# Altium schematic sheet SWITCHING.SchDoc
size A4; DrawnBy: Jakov Sola; SheetNumber: 4; SheetTotal: 6
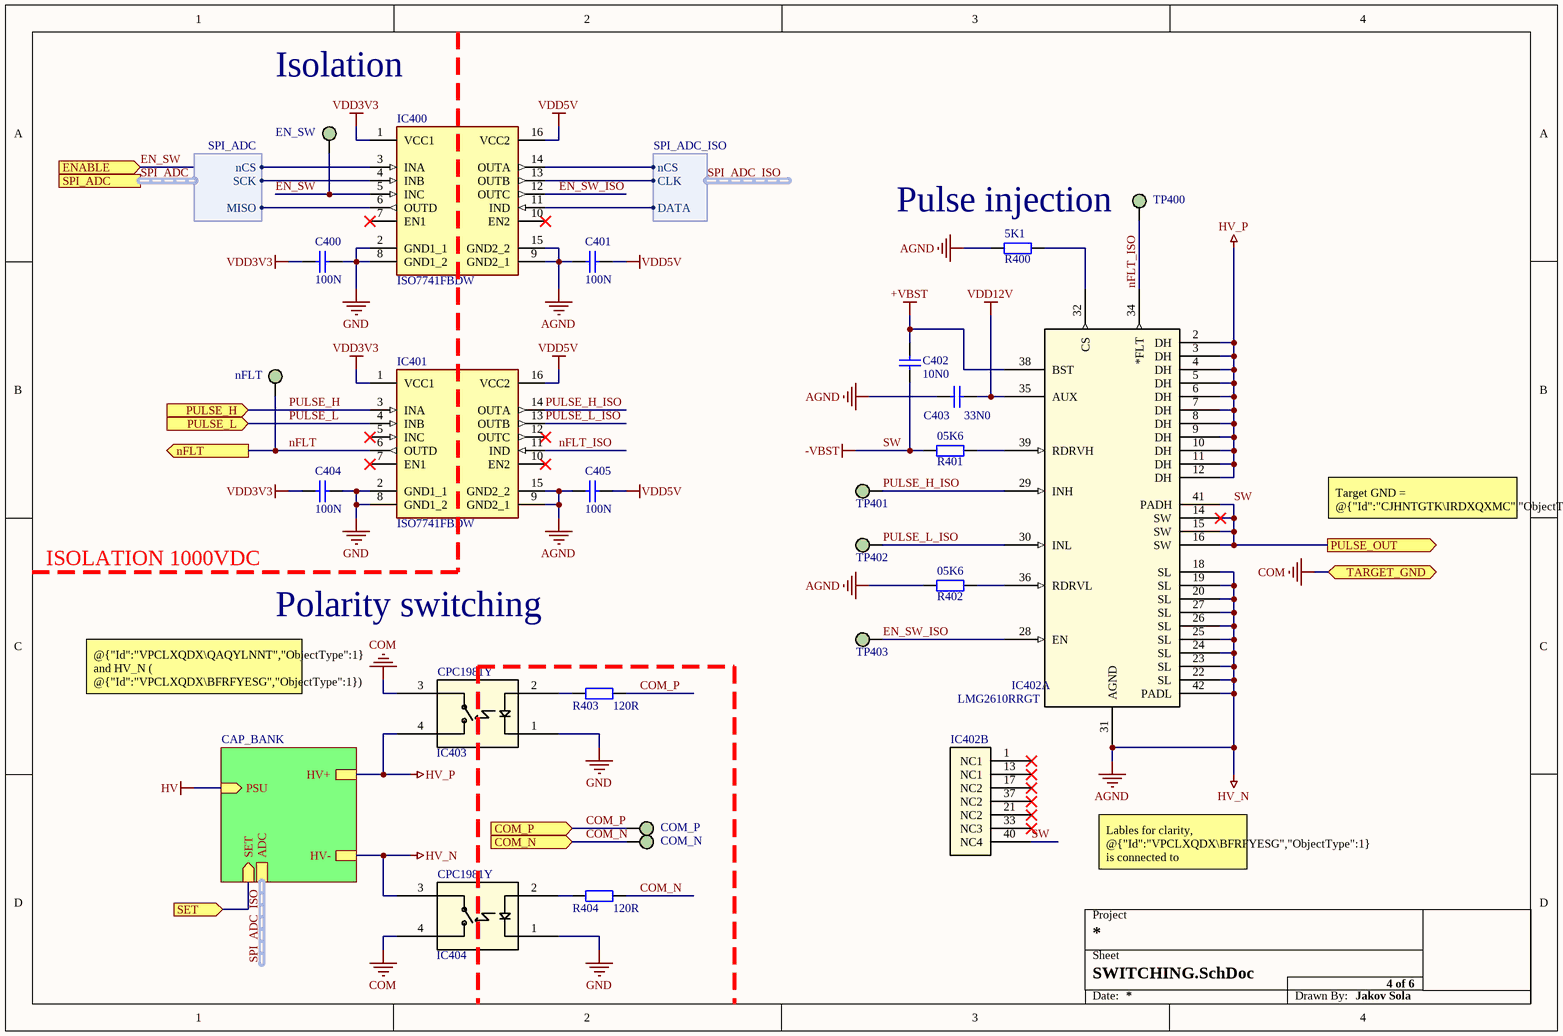
[diagram p0: SWITCHING.SchDoc]

## Parts
C400  VALUE_4C: 100N  [CAPC0603N]  (hidden comment: Cap)
C401  VALUE_4C: 100N  [CAPC0603N]  (hidden comment: Cap)
C402  VALUE_4C: 10N0  [CAPC0603N]  (hidden comment: Cap)
C403  VALUE_4C: 33N0  [CAPC0603N]  (hidden comment: Cap)
C404  VALUE_4C: 100N  [CAPC0603N]  (hidden comment: Cap)
C405  VALUE_4C: 100N  [CAPC0603N]  (hidden comment: Cap)
COM_N  TP  [TP]  (value not drawn)
COM_P  TP  [TP]  (value not drawn)
EN_SW  TP  [TP]  (value not drawn)
IC400  ISO7741FBDW  [SOIC16]
IC401  ISO7741FBDW  [SOIC16]
IC402  LMG2610RRGT  [XLMG2610RRGT]  (parts A,B of 2)
IC403  SSR_SPST_NO  [CPC1981Y]  (value not drawn)
IC404  SSR_SPST_NO  [CPC1981Y]  (value not drawn)
nFLT  TP  [TP]  (value not drawn)
R400  value 5K1  [RESC0603N]  (hidden comment: Res)
R401  VALUE_4C: 05K6  [RESC0603N]  (hidden comment: Res)
R402  VALUE_4C: 05K6  [RESC0603N]  (hidden comment: Res)
R403  VALUE_4C: 120R  [RESC0603N]  (hidden comment: Res)
R404  VALUE_4C: 120R  [RESC0603N]  (hidden comment: Res)
TP400  TP  [TP]  (value not drawn)
TP401  TP  [TP]  (value not drawn)
TP402  TP  [TP]  (value not drawn)
TP403  TP  [TP]  (value not drawn)

## Sub-sheets
CAP_BANK = CAP_BANK.SchDoc: PSU (in), ADC (harness SPI_ADC), SET (in), HV+, HV-

## Ports
COM_N (in), COM_P (in), ENABLE (in), nFLT (out), PULSE_H (in), PULSE_L (in), PULSE_OUT (out), SET (in), SPI_ADC (harness SPI_ADC), TARGET_GND (bidir)

## Harnesses
SPI_ADC_ISO: nCS, DATA, CLK
SPI_ADC: nCS, SCK, MISO

## Nets
+VBST: C402.2 IC402.38(BST)
AGND: C401.2 C403.1 C405.2 IC400.9(GND2_1) IC400.15(GND2_2) IC401.9(GND2_1) IC401.15(GND2_2) IC402.18(SL) IC402.19(SL) IC402.20(SL) IC402.22(SL) IC402.23(SL) IC402.24(SL) IC402.25(SL) IC402.26(SL) IC402.27(SL) IC402.31(AGND) IC402.42(PADL) IC404.3(NOCL1) R400.1 R402.1 ; sheet CAP_BANK/HV-  [also labelled HV_N]
COM: IC403.3(NOCL1) IC404.4(NOOP2) ; port TARGET_GND
GND: C400.1 C404.1 IC400.2(GND1_1) IC400.8(GND1_2) IC401.2(GND1_1) IC401.8(GND1_2) IC403.1(-) IC404.1(-)
HV: sheet CAP_BANK/PSU
HV_P: IC402.2(DH) IC402.3(DH) IC402.4(DH) IC402.5(DH) IC402.6(DH) IC402.7(DH) IC402.8(DH) IC402.9(DH) IC402.10(DH) IC402.11(DH) IC402.12(DH) IC403.4(NOOP2) ; sheet CAP_BANK/HV+
SW: C402.1 IC402.14(SW) IC402.15(SW) IC402.16(SW) IC402.40(NC4) IC402.41(PADH) R401.1 ; port PULSE_OUT  [also labelled -VBST]
VDD3V3: C400.2 C404.2 IC400.1(VCC1) IC401.1(VCC1)
VDD5V: C401.1 C405.1 IC400.16(VCC2) IC401.16(VCC2)
VDD12V: C403.2 IC402.35(AUX)
COM_N: COM_N.TP R404.2 ; port COM_N
COM_P: COM_P.TP R403.2 ; port COM_P
EN_SW: EN_SW.TP IC400.5(INC) ; port ENABLE
EN_SW_ISO: IC400.12(OUTC) IC402.28(EN) TP403.TP
nFLT: IC401.6(OUTD) nFLT.TP ; port nFLT
nFLT_ISO: IC401.11(IND) IC402.34(*FLT) TP400.TP
PULSE_H: IC401.3(INA) ; port PULSE_H
PULSE_H_ISO: IC401.14(OUTA) IC402.29(INH) TP401.TP
PULSE_L: IC401.4(INB) ; port PULSE_L
PULSE_L_ISO: IC401.13(OUTB) IC402.30(INL) TP402.TP
SET: port SET, sheet CAP_BANK/SET
SPI_ADC.MISO: IC400.6(OUTD) ; port SPI_ADC.MISO
SPI_ADC.nCS: IC400.3(INA) ; port SPI_ADC.nCS
SPI_ADC.SCK: IC400.4(INB) ; port SPI_ADC.SCK
SPI_ADC_ISO.CLK: IC400.13(OUTB) ; sheet CAP_BANK/ADC.CLK
SPI_ADC_ISO.DATA: IC400.11(IND) ; sheet CAP_BANK/ADC.DATA
SPI_ADC_ISO.nCS: IC400.14(OUTA) ; sheet CAP_BANK/ADC.nCS
NetIC402_32: IC402.32(CS) R400.2
NetIC402_36: IC402.36(RDRVL) R402.2
NetIC402_39: IC402.39(RDRVH) R401.2
NetIC403_2: IC403.2(+) R403.1
NetIC404_2: IC404.2(+) R404.1

Not connected (* = marked no-connect by the designer): IC400 7(EN1)* 10(EN2)*; IC401 5(INC)* 7(EN1)* 10(EN2)* 12(OUTC)*; IC402 1(NC1)* 13(NC1)* 17(NC2)* 21(NC2)* 33(NC3)* 37(NC2)*

## Buses and harness runs
harness SPI_ADC = port SPI_ADC
harness SPI_ADC_ISO = sheet CAP_BANK/ADC

## Notes on the sheet
- Isolation
- (near TP400) Pulse injection
- Target GND = @{"Id":"CJHNTGTK\IRDXQXMC","ObjectType":1}
  Keep traces as short as possible
- ISOLATION 1000VDC
- Polarity switching
- @{"Id":"VPCLXQDX\QAQYLNNT","ObjectType":1}  and HV_N ( @{"Id":"VPCLXQDX\BFRFYESG","ObjectType":1}) never connected to @{"Id":"CJHNTGTK\IRDXQXMC","ObjectType":1} at the same time
  Take into account t_on and t_off.
- Lables for clarity, @{"Id":"VPCLXQDX\BFRFYESG","ObjectType":1} is connected to @{"Id":"XTKKVGUJ\YZZHXVUT","ObjectType":2} in CAP_BANK
- Project
- Sheet
- Date:
- Drawn By:

## Library data of the parts
C400 C401 C404 C405 = CL10B104KA8WPNC: MANUF: SAMSUNG; DESCR: CAP 100N 0603 25V X7R 10%; VENDOR: DIGI-KEY; VENDORCODE: 1276-6717-1-ND; POPULATE: YES; VALUE: 100N; VOLTAGE: 25V; TOLERANCE: 0.1; MANUFCODE: CL10B104KA8WPNC; PACKAGE: 0603; TECHNOLOGY: X7R
C402 = CGA3E2C0G1H103J080AA: MANUF: TDK; DESCR: CAP 10N0 0603 50V NP0 5%; VENDOR: FARNELL INONE; VENDORCODE: 2210846; POPULATE: YES; VALUE_PF: 10000; VALUE: 10N; VOLTAGE: 50V; TOLERANCE: 0.05; MANUFCODE: CGA3E2C0G1H103J080AA; PACKAGE: 0603; TECHNOLOGY: NP0
C403 = CL10B333KB8NFNC: MANUF: SAMSUNG; DESCR: CAP 33N0 0603 50V X7R 10%; VENDOR: DIGI-KEY; VENDORCODE: 1276-2040-1-ND; POPULATE: YES; VALUE: 33N; VOLTAGE: 50V; TOLERANCE: 0.1; MANUFCODE: CL10B333KB8NFNC; PACKAGE: 0603; TECHNOLOGY: X7R
COM_N COM_P EN_SW nFLT TP400-TP403 = TP: DESCR: TESTPOINT 1.5MM; POPULATE: NA; MANUFCODE: TP
IC400 IC401 = ISO7741FBDW: MANUF: TI; DESCR: IC ISO 3/1 100MBPS 2.25-5.5 V; VENDOR: MOUSER; VENDORCODE: 595-ISO7741FBDW; POPULATE: YES; MANUFCODE: ISO7741FBDW
IC402 = LMG2610RRGT: MANUF: TEXAS INSTRUMENTS; DESCR: IC INT HALF BRIDGE GAN; VENDOR: MOUSER; VENDORCODE: 595-LMG2610RRGT; POPULATE: YES; MANUFCODE: LMG2610RRGT
IC403 IC404 = CPC1981Y: MANUF: IXYS; DESCR: IC SSR SPST NO 1000V 180mA; VENDOR: MOUSER; VENDORCODE: 849-CPC1981Y; POPULATE: YES; MANUFCODE: CPC1981Y
R400 = MC 0.063W 0603 1% 5K1: Resistor; MANUF: MULTICOMP; DESCR: RES 05K1 0603 0.063W 1% 50V 100PPM; VENDOR: FARNELL INONE; VENDORCODE: 9331301; POPULATE: YES; VALUE_MOHM: 5100000; VALUE_4C: 05K1; POWER: 0.063W; TOLERANCE: 1%; VOLTAGE: 50V; TEMPCOEFF: 100PPM; NPOWER: 0.063; NTOLERANCE: 0.01; NVOLTAGE: 50; NTEMPCOEFF: 100; MANUFCODE: MC 0.063W 0603 1% 5K1; PACKAGE: 0603; NVALUE: 5100000
R401 R402 = MC 0.063W 0603 1% 5K6: Resistor; MANUF: MULTICOMP; DESCR: RES 05K6 0603 0.063W 1% 50V 100PPM; VENDOR: FARNELL INONE; VENDORCODE: 9331352; POPULATE: YES; VALUE_MOHM: 5600000; VALUE: 5K6; POWER: 0.063W; TOLERANCE: 1%; VOLTAGE: 50V; TEMPCOEFF: 100PPM; NPOWER: 0.063; NTOLERANCE: 0.01; NVOLTAGE: 50; NTEMPCOEFF: 100; MANUFCODE: MC 0.063W 0603 1% 5K6; PACKAGE: 0603; NVALUE: 5600000
R403 R404 = CRCW0603120RFKEA: Resistor; MANUF: VISHAY; DESCR: RES 120R 0603 0.1W 1% 75V 100PPM; VENDOR: DIGI-KEY; VENDORCODE: 541-120HCT-ND; POPULATE: YES; VALUE_MOHM: 120000; VALUE: 120R; POWER: 0.1W; TOLERANCE: 1%; VOLTAGE: 75V; TEMPCOEFF: 100PPM; NPOWER: 0.1; NTOLERANCE: 0.01; NVOLTAGE: 75; NTEMPCOEFF: 100; MANUFCODE: CRCW0603120RFKEA; PACKAGE: 0603; NVALUE: 120000